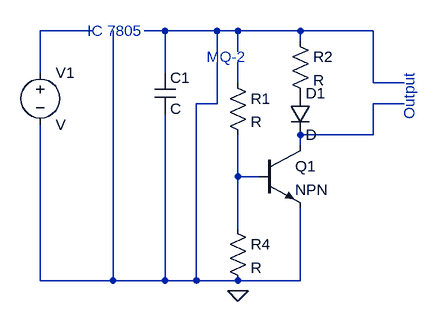
[diagram p0: schematic Draft29.asc]
Draft29.asc, the LTspice schematic file:
Version 4
SHEET 1 880 680
WIRE 96 48 16 48
WIRE 208 48 176 48
WIRE 288 48 208 48
WIRE 320 48 288 48
WIRE 416 48 320 48
WIRE 528 48 416 48
WIRE 416 64 416 48
WIRE 288 80 288 48
WIRE 320 80 320 48
WIRE 16 112 16 48
WIRE 208 112 208 48
WIRE 320 128 320 96
WIRE 528 128 528 48
WIRE 576 128 528 128
WIRE 288 160 288 96
WIRE 288 160 256 160
WIRE 576 160 528 160
WIRE 528 208 528 160
WIRE 528 208 416 208
WIRE 416 224 416 208
WIRE 320 272 320 208
WIRE 352 272 320 272
WIRE 320 352 320 272
WIRE 16 432 16 192
WIRE 128 432 128 48
WIRE 128 432 16 432
WIRE 208 432 208 176
WIRE 208 432 128 432
WIRE 256 432 256 160
WIRE 256 432 208 432
WIRE 320 432 256 432
WIRE 416 432 416 320
WIRE 416 432 320 432
FLAG 320 448 0
SYMBOL voltage 16 96 R0
SYMATTR InstName V1
SYMBOL cap 192 112 R0
SYMATTR InstName C1
SYMBOL res 304 112 R0
SYMATTR InstName R1
SYMBOL res 400 48 R0
SYMATTR InstName R2
SYMBOL diode 400 144 R0
SYMATTR InstName D1
SYMBOL npn 352 224 R0
SYMATTR InstName Q1
SYMBOL res 304 336 R0
SYMATTR InstName R4
TEXT 88 48 Left 2 ;IC 7805
TEXT 272 88 Left 2 ;MQ-2
TEXT 584 184 VLeft 2 ;Output

The netlist it stands for:
* Draft29.asc
V1 N001 N004 V
C1 N002 N004 C
R1 N003 N006 R
R2 N002 P001 R
D1 P001 N005 D
Q1 N005 N006 N004 0 NPN
R4 N006 N004 R
.model D D
.lib standard.dio
.model NPN NPN
.model PNP PNP
.lib standard.bjt
* IC 7805
* MQ-2
* Output
.backanno
.end